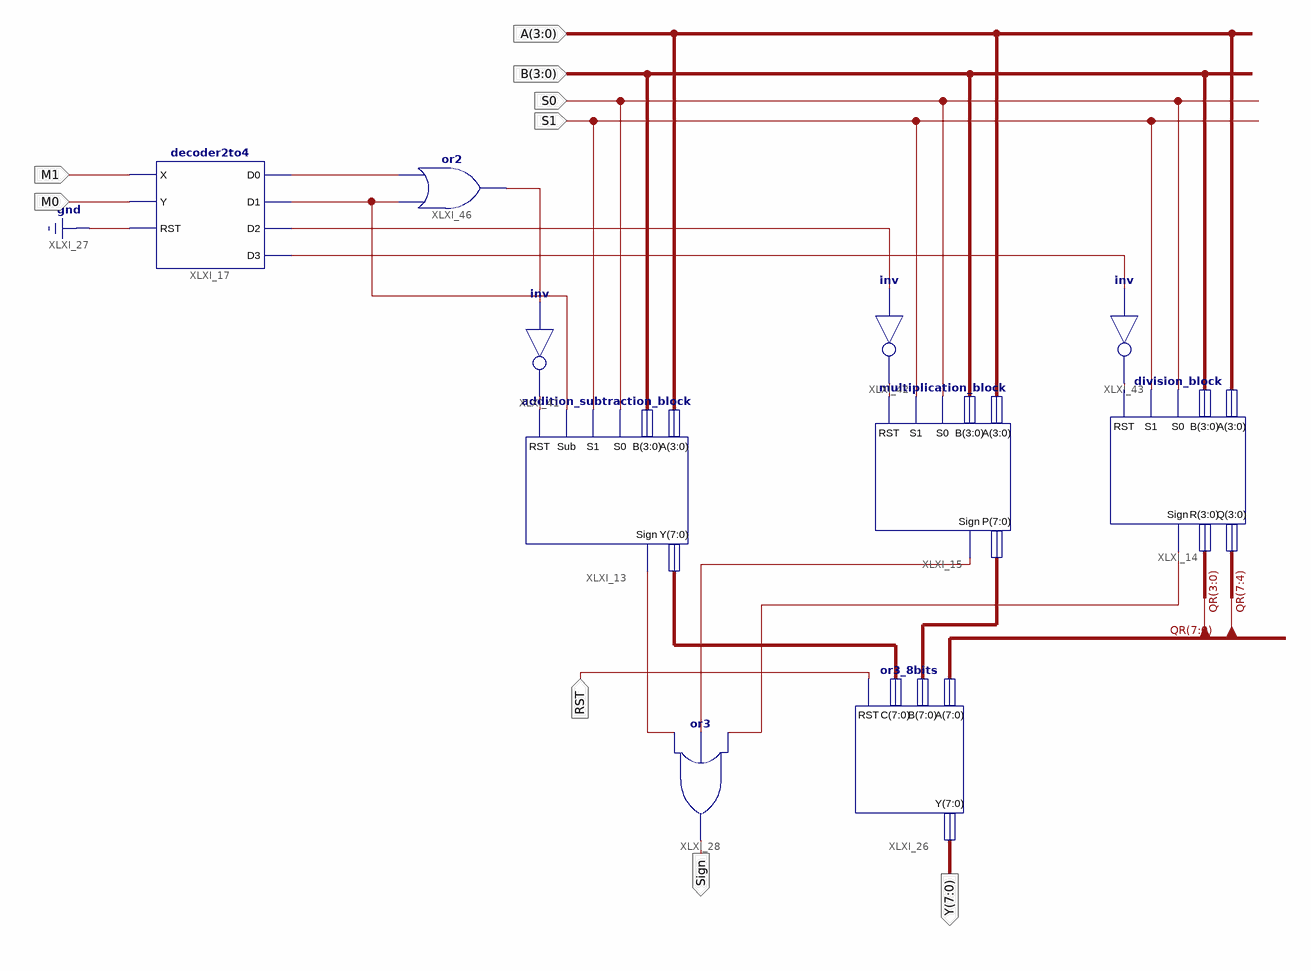
[diagram p0: schematic sheet 1]
// Xilinx ISE schematic signed_calculator.sch (artix7) as structural Verilog: 10 symbols, 9 ports
module signed_calculator (
  input  [3:0] A,
  input  [3:0] B,
  input  S0,
  input  S1,
  input  M1,
  input  M0,
  input  RST,
  output [7:0] Y,
  output Sign
);

  wire XLXN_86, XLXN_88, XLXN_89, XLXN_131, XLXN_133, XLXN_134, XLXN_154, XLXN_155, XLXN_156, XLXN_163,
       XLXN_164;
  wire [7:0] QR, XLXN_119, XLXN_120;

  addition_subtraction_block XLXI_13 (
    .A(A), .B(B), .RST(XLXN_154), .S0(S0), .S1(S1), .Sign(XLXN_131), .Sub(XLXN_163), .Y(XLXN_119));
  multiplication_block XLXI_15 (.A(A), .B(B), .P(XLXN_120), .RST(XLXN_155), .S0(S0), .S1(S1), .Sign(XLXN_133));
  decoder2to4 XLXI_17 (.D0(XLXN_86), .D1(XLXN_163), .D2(XLXN_88), .D3(XLXN_89), .RST(1'b0), .X(M1), .Y(M0));
  or3_8bits XLXI_26 (.A(QR), .B(XLXN_120), .C(XLXN_119), .RST(RST), .Y(Y));
  or XLXI_28 (Sign, XLXN_131, XLXN_133, XLXN_134);
  not XLXI_41 (XLXN_154, XLXN_164);
  not XLXI_42 (XLXN_155, XLXN_88);
  not XLXI_43 (XLXN_156, XLXN_89);
  or XLXI_46 (XLXN_164, XLXN_163, XLXN_86);
  division_block XLXI_14 (.A(A), .B(B), .RST(XLXN_156), .S0(S0), .S1(S1), .Q(QR[7:4]), .R(QR[3:0]), .Sign(XLXN_134));
endmodule
